# Altium project 2020年电赛校赛功率板.PrjPcb
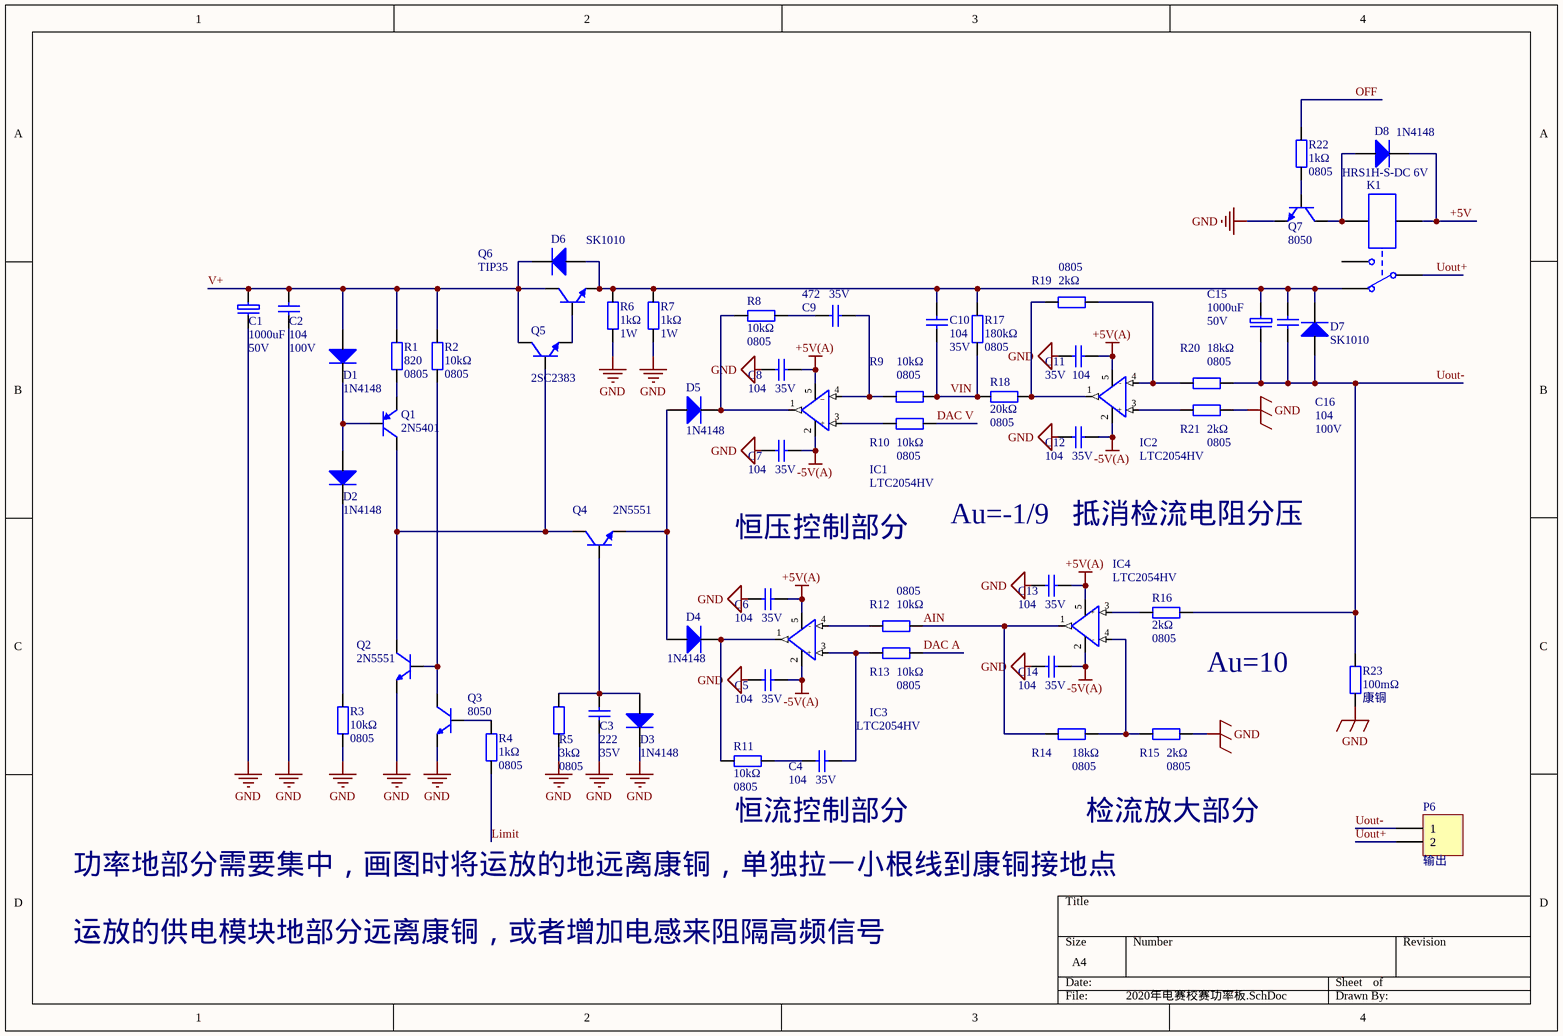
[diagram p0: 2020年电赛校赛功率板.SchDoc]
3 sheets, 145 parts. Net scope: global (net labels, ports and power ports of the same name join across sheets).
Board file: 2020年电赛校赛功率板.PcbDoc
Sheets:
  2020年电赛校赛功率板.SchDoc
  2020年电赛校赛测量、基准板.SchDoc
  2020年电赛校赛电源板.SchDoc

## Sheet 2020年电赛校赛功率板.SchDoc
size A4

### Parts
C1  1000uF  value 50V  [CR132(Φ13.2,间距5.1)]
C2  104  value 100V  [C0805]
C3  222  value 35V  [C0805]
C4  104  value 35V  [C0805]
C5  104  value 35V  [C0805]
C6  104  value 35V  [C0805]
C7  104  value 35V  [C0805]
C8  104  value 35V  [C0805]
C9  472  value 35V  [C0805]
C10  104  value 35V  [C0805]
C11  104  value 35V  [C0805]
C12  104  value 35V  [C0805]
C13  104  value 35V  [C0805]
C14  104  value 35V  [C0805]
C15  1000uF  value 50V  [CR132(Φ13.2,间距5.1)]
C16  104  value 100V  [C0805]
D1  1N4148  [LL34]
D2  1N4148  [LL34]
D3  1N4148  [LL34]
D4  1N4148  [LL34]
D5  1N4148  [LL34]
D6  SK1010  [SMC(DO-214AB)]
D7  SK1010  [SMC(DO-214AB)]
D8  1N4148  [LL34]
IC1  LTC2054HV  [TSOT-32-5]
IC2  LTC2054HV  [TSOT-32-5]
IC3  LTC2054HV  [TSOT-32-5]
IC4  LTC2054HV  [TSOT-32-5]
K1  HRS1H-S-DC 6V  [继电器]
P6  输出  [KF7.62-2P]
Q1  2N5401  [SOT-23]
Q2  2N5551  [SOT-23]
Q3  8050  [SOT-23]
Q4  2N5551  [SOT-23]
Q5  2SC2383  [TO-92]
Q6  TIP35  [TO-247]
Q7  8050  [SOT-23]
R1  820  value 0805  [R0805]
R2  10kΩ  value 0805  [R0805]
R3  10kΩ  value 0805  [R0805]
R4  1kΩ  value 0805  [R0805]
R5  3kΩ  value 0805  [R0805]
R6  1kΩ  value 1W  [RES-1W(立式)]
R7  1kΩ  value 1W  [RES-1W(立式)]
R8  10kΩ  value 0805  [R0805]
R9  10kΩ  value 0805  [R0805]
R10  10kΩ  value 0805  [R0805]
R11  10kΩ  value 0805  [R0805]
R12  10kΩ  value 0805  [R0805]
R13  10kΩ  value 0805  [R0805]
R14  18kΩ  value 0805  [R0805]
R15  2kΩ  value 0805  [R0805]
R16  2kΩ  value 0805  [R0805]
R17  180kΩ  value 0805  [R0805]
R18  20kΩ  value 0805  [R0805]
R19  2kΩ  value 0805  [R0805]
R20  18kΩ  value 0805  [R0805]
R21  2kΩ  value 0805  [R0805]
R22  1kΩ  value 0805  [R0805]
R23  100mΩ  value 康铜  [100mΩ康铜]

### Nets
+5V: D8.2(K) K1.2
+5V(A): C6.2 C8.2 C11.2 C13.2 IC1.5 IC2.5 IC3.5 IC4.5
-5V(A): C5.2 C7.2 C12.2 C14.2 IC1.2 IC2.2 IC3.2 IC4.2
GND: C1.2(-) C2.1 C3.1 C5.1 C6.1 C7.1 C8.1 C11.1 C12.1 C13.1 C14.1 D3.2(K) Q2.3(E) Q3.3(E) Q7.3(E) R3.1 R5.1 R6.1 R7.1 R15.1 R21.1 R23.2
AIN: IC4.1 R12.2 R14.2
DAC A: R13.2
DAC V: R10.2
Limit: R4.1
OFF: R22.2
Uout+: K1.4 P6.2
Uout-: C15.2(-) C16.1 D7.1(A) P6.1 R16.1 R20.1 R23.1
V+: C1.1(+) C2.2 D1.1(A) D6.2(K) Q5.2(C) Q6.2(C) R1.2 R2.2
VIN: C10.1 R9.2 R17.1 R18.1
NetC3_2: C3.2 D3.1(A) Q4.1(B) R5.2
NetC4_1: C4.1 R11.2
NetC4_2: C4.2 IC3.3(+) R13.1
NetC9_1: C9.1 R8.2
NetC9_2: C9.2 IC1.4(_) R9.1
NetC10_2: C10.2 C15.1(+) C16.2 D6.1(A) D7.2(K) K1.1 Q6.3(E) R6.2 R7.2 R17.2
NetD1_2: D1.2(K) D2.1(A) Q1.1(B)
NetD2_2: D2.2(K) R3.2
NetD4_1: D4.1(A) D5.1(A) Q4.3(E)
NetD4_2: D4.2(K) IC3.1 R11.1
NetD5_2: D5.2(K) IC1.1 R8.1
NetD8_1: D8.1(A) K1.5 Q7.1(C)
NetIC1_3: IC1.3(+) R10.1
NetIC2_1: IC2.1 R18.2 R19.2
NetIC2_3: IC2.3(+) R21.2
NetIC2_4: IC2.4(-) R19.1 R20.2
NetIC3_4: IC3.4(-) R12.1
NetIC4_3: IC4.3(+) R16.2
NetIC4_4: IC4.4(-) R14.1 R15.2
NetQ1_2: Q1.2(C) Q2.2(C) Q4.2(C) Q5.3(B)
NetQ1_3: Q1.3(E) R1.1
NetQ2_1: Q2.1(B) Q3.2(C) R2.1
NetQ3_1: Q3.1(B) R4.2
NetQ5_1: Q5.1(E) Q6.1(B)
NetQ7_2: Q7.2(B) R22.1

Not connected (* = marked no-connect by the designer): K1 6

### Notes on the sheet
- 恒压控制部分
- Au=-1/9
- 抵消检流电阻分压
- Au=10
- 恒流控制部分
- 检流放大部分
- 功率地部分需要集中，画图时将运放的地远离康铜，单独拉一小根线到康铜接地点
- 运放的供电模块地部分远离康铜，或者增加电感来阻隔高频信号

### Library data of the parts
C1 C15 = 100uF: 有极性电容
C2-C14 C16 = 104: 无极性电容
D1-D8 = Diode: 二极管
IC1-IC4 = OPA350UA: 运放
K1 = HRS1H-S-DC 6V: 继电器
P6 = Header 2: Header, 2-Pin; LatestRevisionDate: 17-Jul-2002; LatestRevisionNote: Re-released for DXP Platform.; Publisher: Altium Limited
Q1 = PNP
Q2 = NPN!
Q3 = NPN!: 三极管
Q4-Q7 = NPN: 三极管
R1-R23 = 10kΩ: 贴片/直插电阻

## Sheet 2020年电赛校赛测量、基准板.SchDoc
size A4
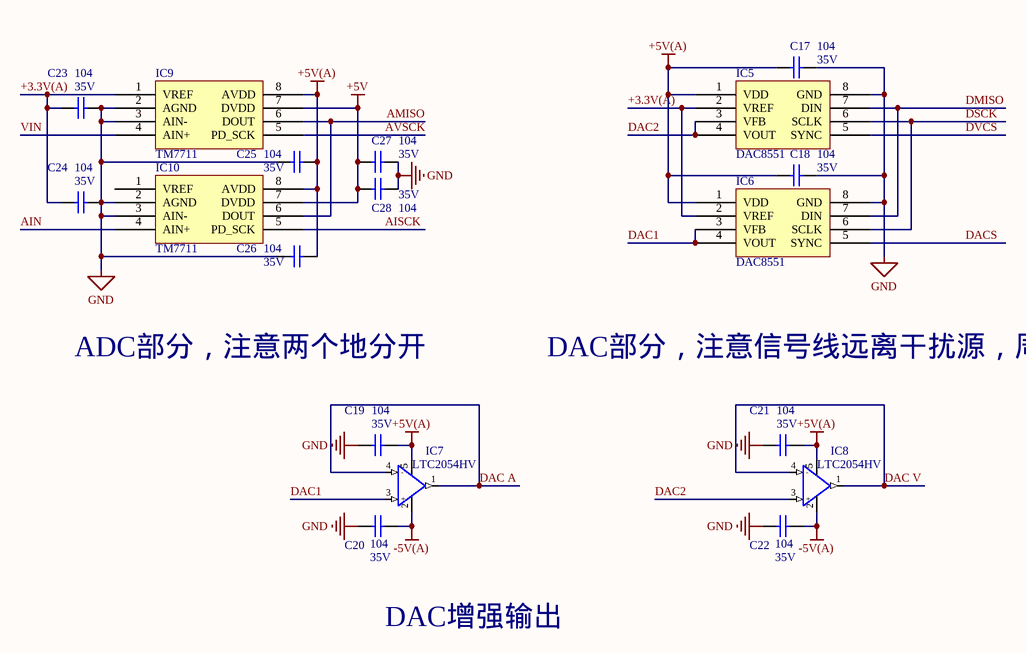
[diagram p1: 2020年电赛校赛测量、基准板.SchDoc]

### Parts
C17  104  value 35V  [C0805]
C18  104  value 35V  [C0805]
C19  104  value 35V  [C0805]
C20  104  value 35V  [C0805]
C21  104  value 35V  [C0805]
C22  104  value 35V  [C0805]
C23  104  value 35V  [C0805]
C24  104  value 35V  [C0805]
C25  104  value 35V  [C0805]
C26  104  value 35V  [C0805]
C27  104  value 35V  [C0805]
C28  104  value 35V  [C0805]
IC5  DAC8551  [MSOP-8]
IC6  DAC8551  [MSOP-8]
IC7  LTC2054HV  [TSOT-32-5]
IC8  LTC2054HV  [TSOT-32-5]
IC9  TM7711  [SOP-8(体宽3.8mm)]
IC10  TM7711  [SOP-8(体宽3.8mm)]

### Nets
+5V: C27.1 C28.1 IC9.7(DVDD) IC10.7(DVDD)
+5V(A): C17.1 C18.1 C19.2 C21.2 C25.2 C26.2 IC5.1(VDD) IC6.1(VDD) IC7.5 IC8.5 IC9.8(AVDD) IC10.8(AVDD)
-5V(A): C20.2 C22.2 IC7.2 IC8.2
GND: C17.2 C18.2 C19.1 C20.1 C21.1 C22.1 C23.2 C24.2 C25.1 C26.1 C27.2 C28.2 IC5.8(GND) IC6.8(GND) IC9.2(AGND) IC9.3(AIN-) IC10.2(AGND) IC10.3(AIN-)
+3.3V(A): C23.1 C24.1 IC5.2(VREF) IC6.2(VREF) IC9.1(VREF)
AIN: IC10.4(AIN+)
AISCK: IC10.5(PD_SCK)
AMISO: IC9.6(DOUT) IC10.6(DOUT)
AVSCK: IC9.5(PD_SCK)
DAC1: IC6.3(VFB) IC6.4(VOUT) IC7.3(+)
DAC2: IC5.3(VFB) IC5.4(VOUT) IC8.3(+)
DAC A: IC7.1 IC7.4(-)
DAC V: IC8.1 IC8.4(-)
DACS: IC6.5(SYNC)
DMISO: IC5.7(DIN) IC6.7(DIN)
DSCK: IC5.6(SCLK) IC6.6(SCLK)
DVCS: IC5.5(SYNC)
VIN: IC9.4(AIN+)

Not connected (* = marked no-connect by the designer): IC10 1(VREF)

### Notes on the sheet
- ADC部分，注意两个地分开
- DAC部分，注意信号线远离干扰源，周围围模拟地
- DAC增强输出

### Library data of the parts
C17-C28 = 104: 无极性电容
IC7 IC8 = OPA350UA: 运放

## Sheet 2020年电赛校赛电源板.SchDoc
size A4
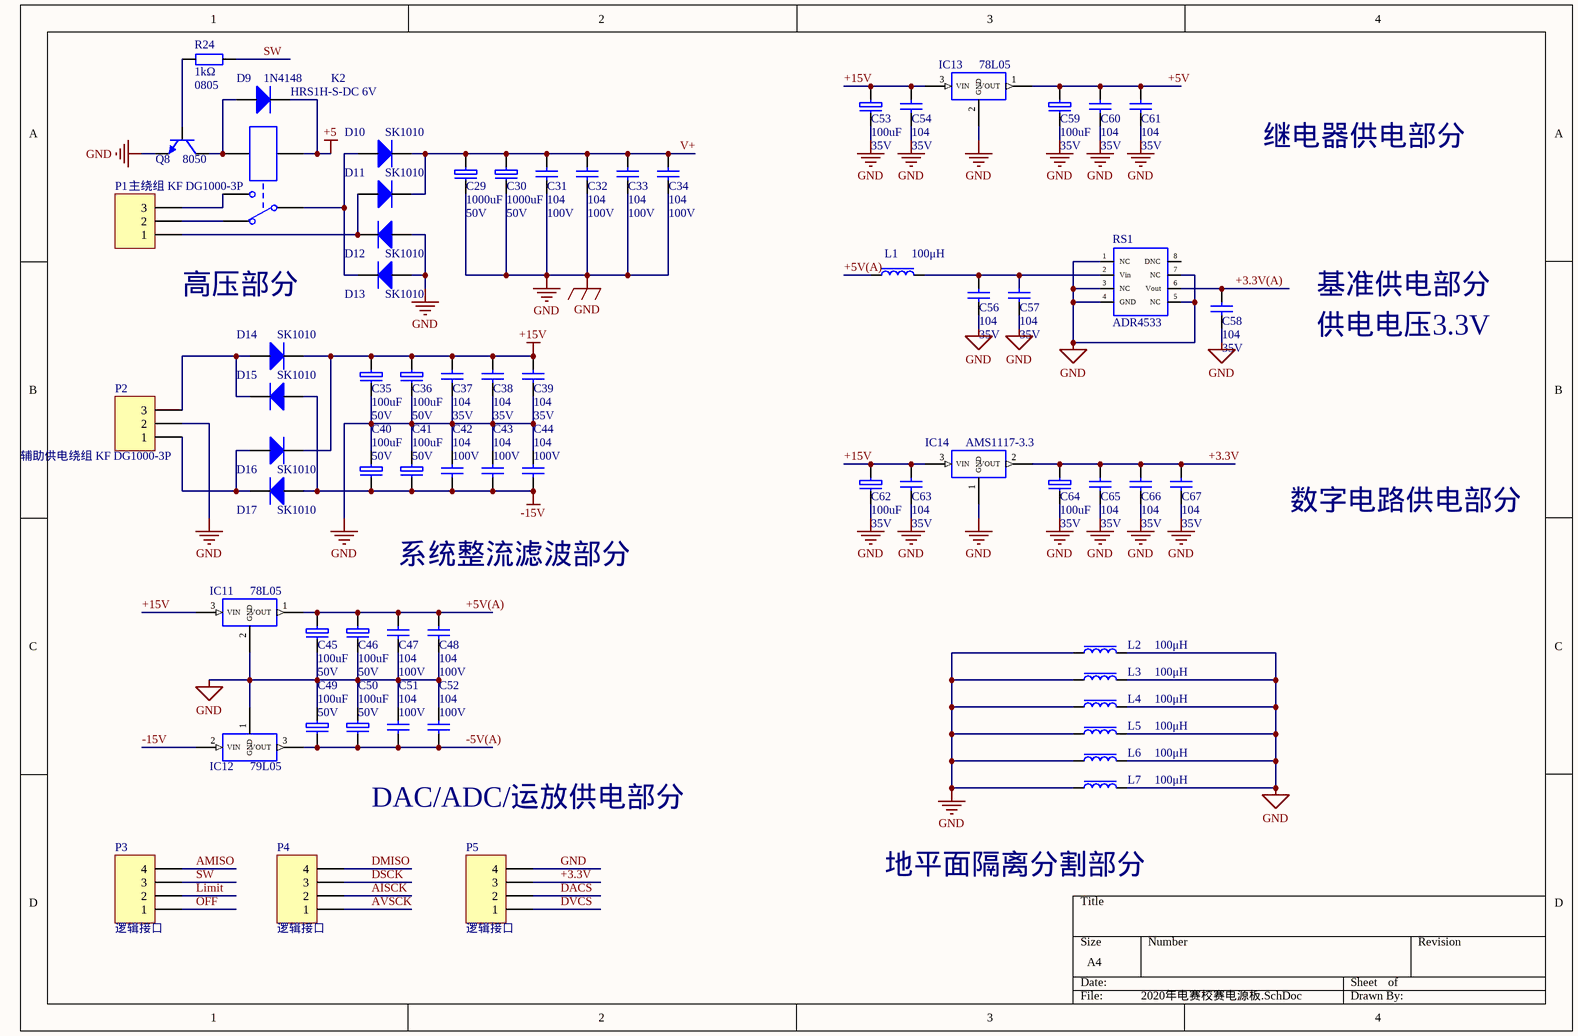
[diagram p2: 2020年电赛校赛电源板.SchDoc]

### Parts
C29  1000uF  value 50V  [CR132(Φ13.2,间距5.1)]
C30  1000uF  value 50V  [CR132(Φ13.2,间距5.1)]
C31  104  value 100V  [C0805]
C32  104  value 100V  [C0805]
C33  104  value 100V  [C0805]
C34  104  value 100V  [C0805]
C35  100uF  value 50V  [CR100(Φ10.0,间距4.9）]
C36  100uF  value 50V  [CR100(Φ10.0,间距4.9）]
C37  104  value 35V  [C0805]
C38  104  value 35V  [C0805]
C39  104  value 35V  [C0805]
C40  100uF  value 50V  [CR100(Φ10.0,间距4.9）]
C41  100uF  value 50V  [CR100(Φ10.0,间距4.9）]
C42  104  value 100V  [C0805]
C43  104  value 100V  [C0805]
C44  104  value 100V  [C0805]
C45  100uF  value 50V  [CR100(Φ10.0,间距4.9）]
C46  100uF  value 50V  [CR100(Φ10.0,间距4.9）]
C47  104  value 100V  [C0805]
C48  104  value 100V  [C0805]
C49  100uF  value 50V  [CR100(Φ10.0,间距4.9）]
C50  100uF  value 50V  [CR100(Φ10.0,间距4.9）]
C51  104  value 100V  [C0805]
C52  104  value 100V  [C0805]
C53  100uF  value 35V  [CR100(Φ10.0,间距4.9）]
C54  104  value 35V  [C0805]
C56  104  value 35V  [C0805]
C57  104  value 35V  [C0805]
C58  104  value 35V  [C0805]
C59  100uF  value 35V  [CT 10*6 - C]
C60  104  value 35V  [C0805]
C61  104  value 35V  [C0805]
C62  100uF  value 35V  [CR100(Φ10.0,间距4.9）]
C63  104  value 35V  [C0805]
C64  100uF  value 35V  [CT 10*6 - C]
C65  104  value 35V  [C0805]
C66  104  value 35V  [C0805]
C67  104  value 35V  [C0805]
D9  1N4148  [LL34]
D10  SK1010  [SMC(DO-214AB)]
D11  SK1010  [SMC(DO-214AB)]
D12  SK1010  [SMC(DO-214AB)]
D13  SK1010  [SMC(DO-214AB)]
D14  SK1010  [SMC(DO-214AB)]
D15  SK1010  [SMC(DO-214AB)]
D16  SK1010  [SMC(DO-214AB)]
D17  SK1010  [SMC(DO-214AB)]
IC11  78L05  [SOT-89]
IC12  79L05  [SOT-89]
IC13  78L05  [SOT-89]
IC14  AMS1117-3.3  [SOT-89]
K2  HRS1H-S-DC 6V  [继电器]
L1  100μH  [R0805]
L2  100μH  [R0805]
L3  100μH  [R0805]
L4  100μH  [R0805]
L5  100μH  [R0805]
L6  100μH  [R0805]
L7  100μH  [R0805]
P1  主绕组 KF DG1000-3P  [KF7.62-3P]
P2  辅助供电绕组 KF DG1000-3P  [KF7.62-3P]
P3  逻辑接口  [XH2.54-4P]
P4  逻辑接口  [XH2.54-4P]
P5  逻辑接口  [XH2.54-4P]
Q8  8050  [SOT-23]
R24  1kΩ  value 0805  [R0805]
RS1  ADR4533  [SOP-8(体宽3.8mm)]

### Nets
+5: D9.2(K) K2.2
+5V: C59.1(+) C60.2 C61.2 IC13.1(VOUT)
+5V(A): C45.1(+) C46.1(+) C47.2 C48.2 IC11.1(VOUT) L1.2
+15V: C35.1(+) C36.1(+) C37.2 C38.2 C39.2 C53.1(+) C54.2 C62.1(+) C63.2 D14.2(K) D16.2(K) IC11.3(VIN) IC13.3(VIN) IC14.3(VIN)
-5V(A): C49.2(-) C50.2(-) C51.1 C52.1 IC12.3(VOUT)
-15V: C40.2(-) C41.2(-) C42.1 C43.1 C44.1 D15.1(A) D17.1(A) IC12.2(VIN)
GND: C29.2(-) C30.2(-) C31.1 C32.1 C33.1 C34.1 C35.2(-) C36.2(-) C37.1 C38.1 C39.1 C40.1(+) C41.1(+) C42.2 C43.2 C44.2 C45.2(-) C46.2(-) C47.1 C48.1 C49.1(+) C50.1(+) C51.2 C52.2 C53.2(-) C54.1 C56.1 C57.1 C58.1 C59.2(-) C60.1 C61.1 C62.2(-) C63.1 C64.2(-) C65.1 C66.1 C67.1 D12.1(A) D13.1(A) IC11.2(GND) IC12.1(GND) IC13.2(GND) IC14.1(GND) L2.1 L2.2 L3.1 L3.2 L4.1 L4.2 L5.1 L5.2 L6.1 L6.2 L7.1 L7.2 P2.2 P5.4 Q8.3(E) RS1.1(NC) RS1.3(NC) RS1.4(GND) RS1.5(NC) RS1.7(NC)
+3.3V: C64.1(+) C65.2 C66.2 C67.2 IC14.2(VOUT) P5.3
+3.3V(A): C58.2 RS1.6(Vout)
AISCK: P4.2
AMISO: P3.4
AVSCK: P4.1
DACS: P5.2
DMISO: P4.4
DSCK: P4.3
DVCS: P5.1
Limit: P3.2
OFF: P3.1
SW: P3.3 R24.2
V+: C29.1(+) C30.1(+) C31.2 C32.2 C33.2 C34.2 D10.2(K) D11.2(K)
NetC56_2: C56.2 C57.2 L1.1 RS1.2(Vin)
NetD9_1: D9.1(A) K2.5 Q8.2(C)
NetD10_1: D10.1(A) D13.2(K) K2.4
NetD11_1: D11.1(A) D12.2(K) P1.1
NetD14_1: D14.1(A) D15.2(K) P2.3
NetD16_1: D16.1(A) D17.2(K) P2.1
NetK2_1: K2.1 P1.2
NetK2_6: K2.6 P1.3
NetQ8_1: Q8.1(B) R24.1

Not connected (* = marked no-connect by the designer): RS1 8(DNC)

### Notes on the sheet
- 继电器供电部分
- 高压部分
- 基准供电部分
- 供电电压3.3V
- 数字电路供电部分
- 系统整流滤波部分
- DAC/ADC/运放供电部分
- 地平面隔离分割部分

### Library data of the parts
C29 C30 C35 C36 C40 C41 C45 C46 C49 C50 C53 C59 C62 C64 = 100uF: 有极性电容
C31-C34 C37-C39 C42-C44 C47 C48 C51 C52 C54 C56-C58 C60 C61 C63 C65-C67 = 104: 无极性电容
D9-D17 = Diode: 二极管
IC11 IC13 IC14 = AMS1117-3.3: LDO
IC12 = 790?: LDO
K2 = HRS1H-S-DC 6V: 继电器
L1-L7 = 470mH: 电感
P1 P2 = Header 3: Header, 3-Pin; LatestRevisionDate: 17-Jul-2002; LatestRevisionNote: Re-released for DXP Platform.; Publisher: Altium Limited
P3-P5 = Header 4: Header, 4-Pin; LatestRevisionDate: 17-Jul-2002; LatestRevisionNote: Re-released for DXP Platform.; Publisher: Altium Limited
Q8 = NPN: 三极管
R24 = 10kΩ: 贴片/直插电阻
RS1 = ADR4533: 高精度基准源

## Nets that join several sheets
+5V: 2020年电赛校赛功率板 (D8.2 K1.2), 2020年电赛校赛测量、基准板 (C27.1 C28.1 IC9.7 IC10.7), 2020年电赛校赛电源板 (C59.1 C60.2 C61.2 IC13.1)
+5V(A): 2020年电赛校赛功率板 (8 pins), 2020年电赛校赛测量、基准板 (12 pins), 2020年电赛校赛电源板 (6 pins)
-5V(A): 2020年电赛校赛功率板 (8 pins), 2020年电赛校赛测量、基准板 (C20.2 C22.2 IC7.2 IC8.2), 2020年电赛校赛电源板 (5 pins)
GND: 2020年电赛校赛功率板 (22 pins), 2020年电赛校赛测量、基准板 (18 pins), 2020年电赛校赛电源板 (64 pins)
+3.3V(A): 2020年电赛校赛测量、基准板 (5 pins), 2020年电赛校赛电源板 (C58.2 RS1.6)
AIN: 2020年电赛校赛功率板 (IC4.1 R12.2 R14.2), 2020年电赛校赛测量、基准板 (IC10.4)
AISCK: 2020年电赛校赛测量、基准板 (IC10.5), 2020年电赛校赛电源板 (P4.2)
AMISO: 2020年电赛校赛测量、基准板 (IC9.6 IC10.6), 2020年电赛校赛电源板 (P3.4)
AVSCK: 2020年电赛校赛测量、基准板 (IC9.5), 2020年电赛校赛电源板 (P4.1)
DAC A: 2020年电赛校赛功率板 (R13.2), 2020年电赛校赛测量、基准板 (IC7.1 IC7.4)
DAC V: 2020年电赛校赛功率板 (R10.2), 2020年电赛校赛测量、基准板 (IC8.1 IC8.4)
DACS: 2020年电赛校赛测量、基准板 (IC6.5), 2020年电赛校赛电源板 (P5.2)
DMISO: 2020年电赛校赛测量、基准板 (IC5.7 IC6.7), 2020年电赛校赛电源板 (P4.4)
DSCK: 2020年电赛校赛测量、基准板 (IC5.6 IC6.6), 2020年电赛校赛电源板 (P4.3)
DVCS: 2020年电赛校赛测量、基准板 (IC5.5), 2020年电赛校赛电源板 (P5.1)
Limit: 2020年电赛校赛功率板 (R4.1), 2020年电赛校赛电源板 (P3.2)
OFF: 2020年电赛校赛功率板 (R22.2), 2020年电赛校赛电源板 (P3.1)
V+: 2020年电赛校赛功率板 (8 pins), 2020年电赛校赛电源板 (8 pins)
VIN: 2020年电赛校赛功率板 (C10.1 R9.2 R17.1 R18.1), 2020年电赛校赛测量、基准板 (IC9.4)